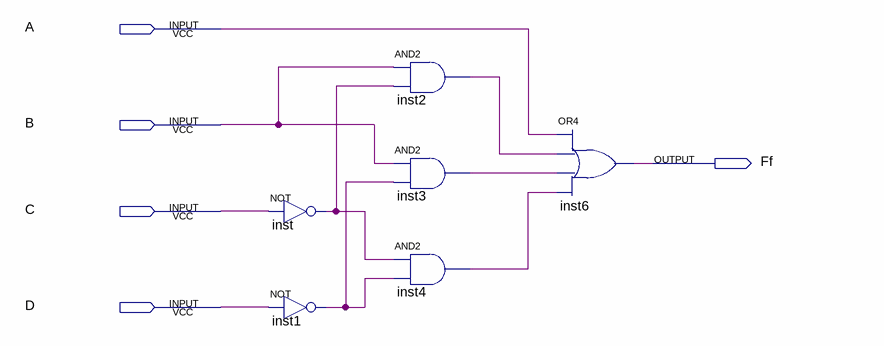
[diagram p0: schematic sheet]
// Quartus schematic Ff.bdf as structural Verilog: 6 symbols, 5 pins
module Ff (
  input  A,
  input  B,
  input  C,
  input  D,
  output Ff
);

  wire inst1_out, inst2_out, inst3_out, inst4_out, inst_out;

  not inst (inst_out, C);
  not inst1 (inst1_out, D);
  and inst2 (inst2_out, B, inst_out);
  and inst3 (inst3_out, B, inst1_out);
  and inst4 (inst4_out, inst_out, inst1_out);
  or inst6 (Ff, A, inst2_out, inst3_out, inst4_out);
endmodule
